# Altium project Power.PrjPCB
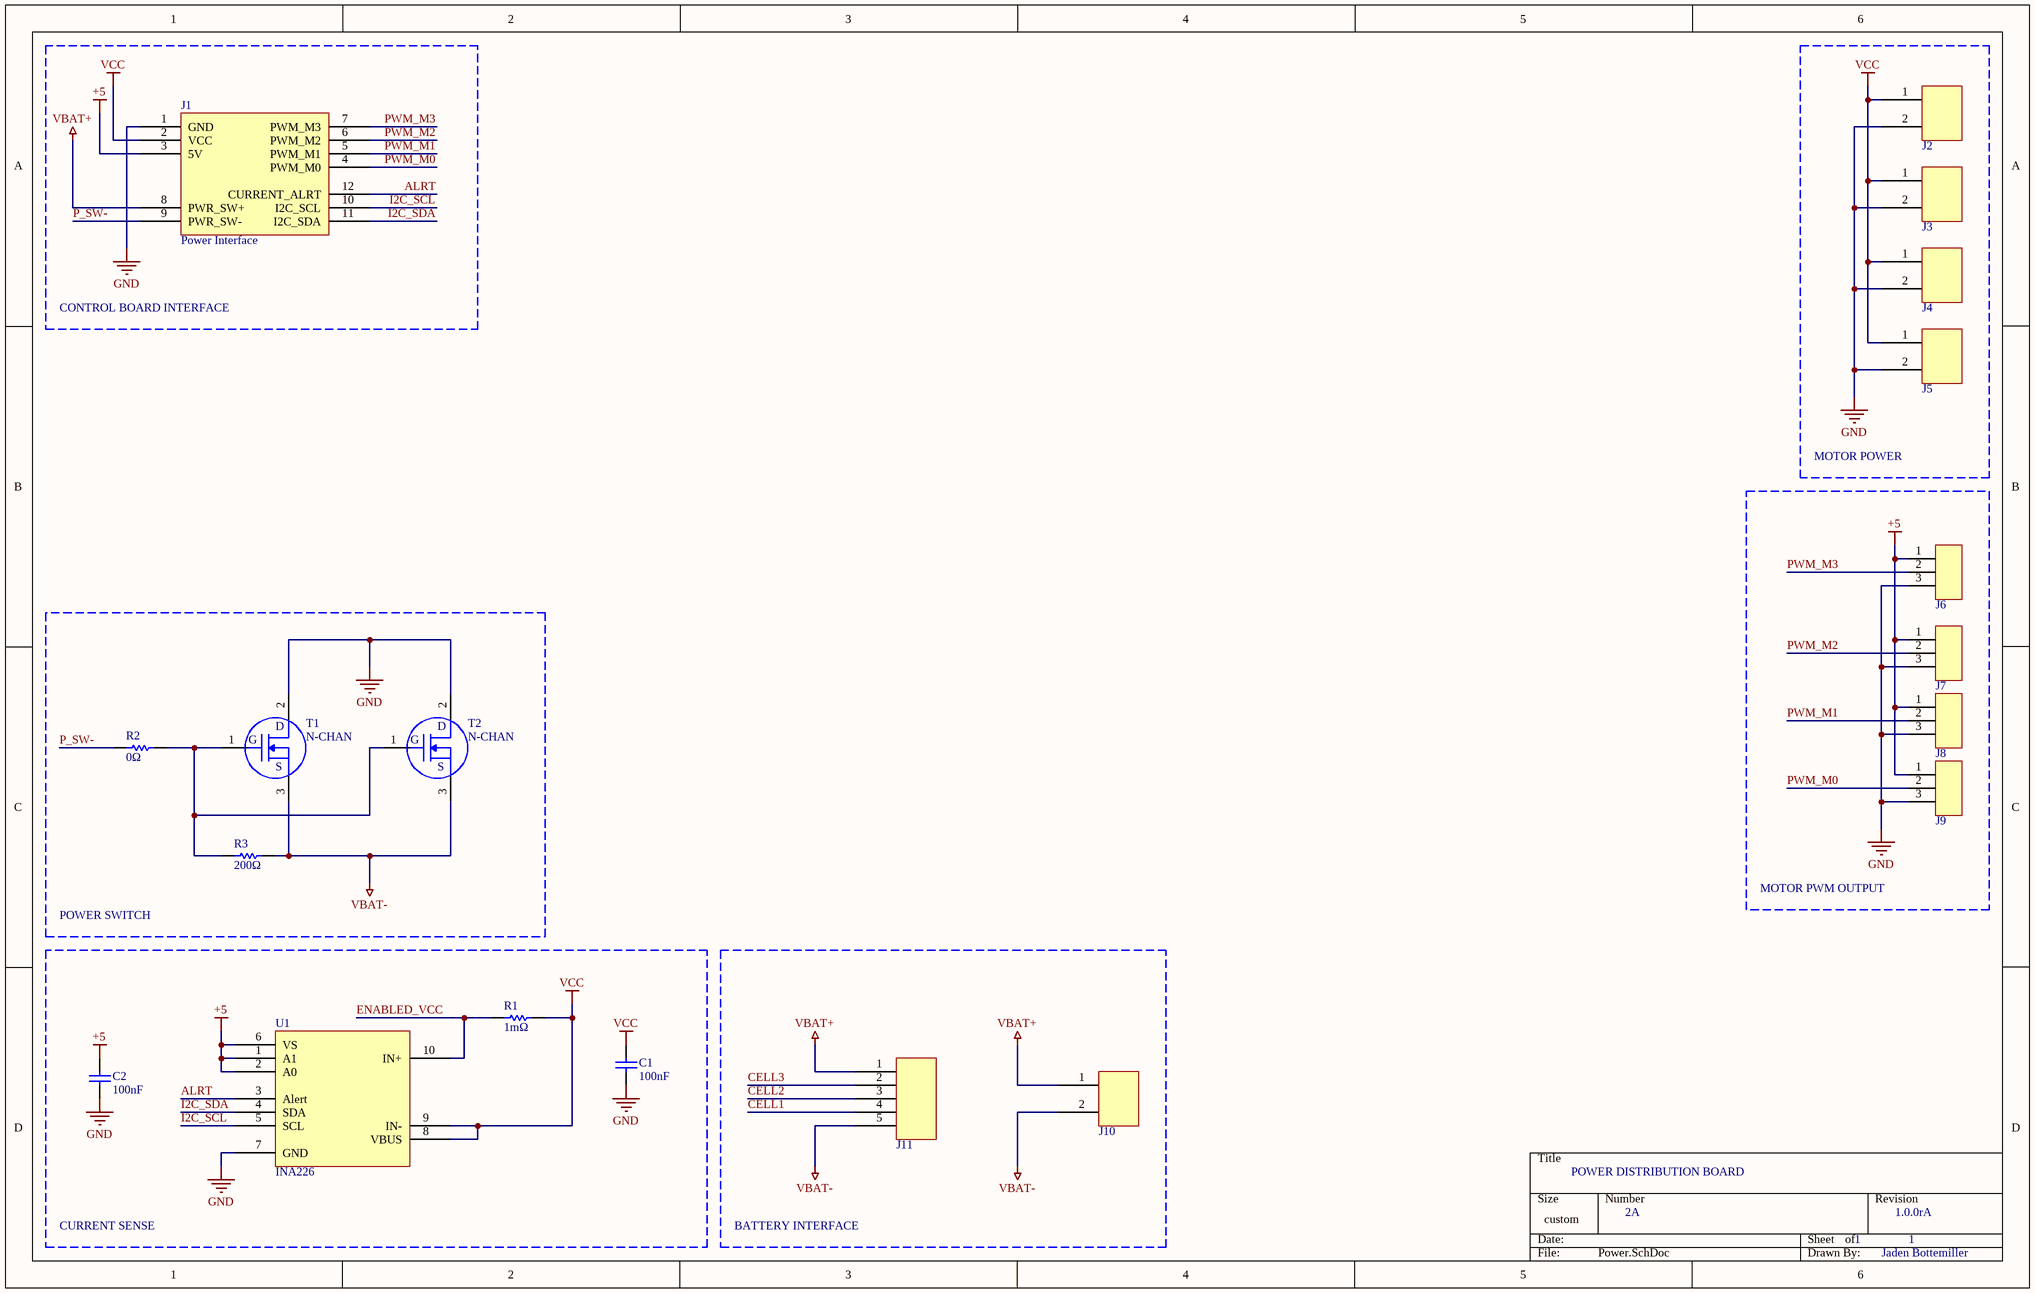
[diagram p0: Power.SchDoc]
1 sheet, 19 parts. Net scope: global (net labels, ports and power ports of the same name join across sheets).

## Sheet Power.SchDoc
size 381 x 241 mm

### Parts
C1  value 100nF  (hidden comment: CAP)
C2  value 100nF  (hidden comment: CAP)
J1  Power Interface
J2  Power Connector  (value not drawn)
J3  Power Connector  (value not drawn)
J4  Power Connector  (value not drawn)
J5  Power Connector  (value not drawn)
J6  3-Pin Signal  (value not drawn)
J7  3-Pin Signal  (value not drawn)
J8  3-Pin Signal  (value not drawn)
J9  3-Pin Signal  (value not drawn)
J10  Power Connector  (value not drawn)
J11  5 Pin Connector  (value not drawn)
R1  value 1mΩ  (hidden comment: RES)
R2  value 0Ω  (hidden comment: RES)
R3  value 200Ω  (hidden comment: RES)
T1  N-CHAN
T2  N-CHAN
U1  INA226

### Blocks framed on the sheet
CONTROL BOARD INTERFACE: J1
MOTOR POWER: J2-J5
MOTOR PWM OUTPUT: J6-J9
POWER SWITCH: R2 R3 T1 T2
CURRENT SENSE: C1 C2 R1 U1
BATTERY INTERFACE: J10 J11

### Nets
+5: C2.2 J1.3(5V) J6.1(Pin) J7.1(Pin) J8.1(Pin) J9.1(Pin) U1.1(A1) U1.2(A0) U1.6(VS)
GND: C1.1 C2.1 J1.1(GND) J2.2(Pin) J3.2(Pin) J4.2(Pin) J5.2(Pin) J6.3(Pin) J7.3(Pin) J8.3(Pin) J9.3(Pin) T1.2(Pin) T2.2(Pin) U1.7(GND)
VBAT+: J1.8(PWR_SW+) J10.1(Pin) J11.1(Pin)
VBAT-: J10.2(Pin) J11.5(Pin) R3.2 T1.3(Pin) T2.3(Pin)
VCC: C1.2 J1.2(VCC) J2.1(Pin) J3.1(Pin) J4.1(Pin) J5.1(Pin) R1.2 U1.8(VBUS) U1.9(IN-)
ALRT: J1.12(CURRENT_ALRT) U1.3(Alert)
CELL1: J11.4(Pin)
CELL2: J11.3(Pin)
CELL3: J11.2(Pin)
ENABLED_VCC: R1.1 U1.10(IN+)
I2C_SCL: J1.10(I2C_SCL) U1.5(SCL)
I2C_SDA: J1.11(I2C_SDA) U1.4(SDA)
P_SW-: J1.9(PWR_SW-) R2.1
PWM_M0: J1.4(PWM_M0) J9.2(Pin)
PWM_M1: J1.5(PWM_M1) J8.2(Pin)
PWM_M2: J1.6(PWM_M2) J7.2(Pin)
PWM_M3: J1.7(PWM_M3) J6.2(Pin)
NetR2_2: R2.2 R3.1 T1.1(Pin) T2.1(Pin)

### Notes on the sheet
- POWER DISTRIBUTION BOARD
- 2A
- 1
- 1.0.0rA
- Jaden Bottemiller
- (in symbol N-MOSFET) D; G; S

### Library data of the parts
C1 C2 = CAP: Standard Capacitor
J1 = PDB_INTERFACE: Interface between power board and control board.
J2-J5 J10 = POWER_CONN: Standard Power Connector
J6-J9 = SIG_3PIN: Standard 3-Pin Signal Connection
J11 = CONN_5PIN: Standard 5 Pin Connector
R1-R3 = RES: Standard Resistor
T1 T2 = N-MOSFET: Standard N-Channel MOSFET. Check pins before designing footprint.
U1 = INA226: Current Monitor Regulator High/Low-Side 10mA